# EAGLE board FMU_V.2 (EAGLE 7.4.0), part 1 of 2
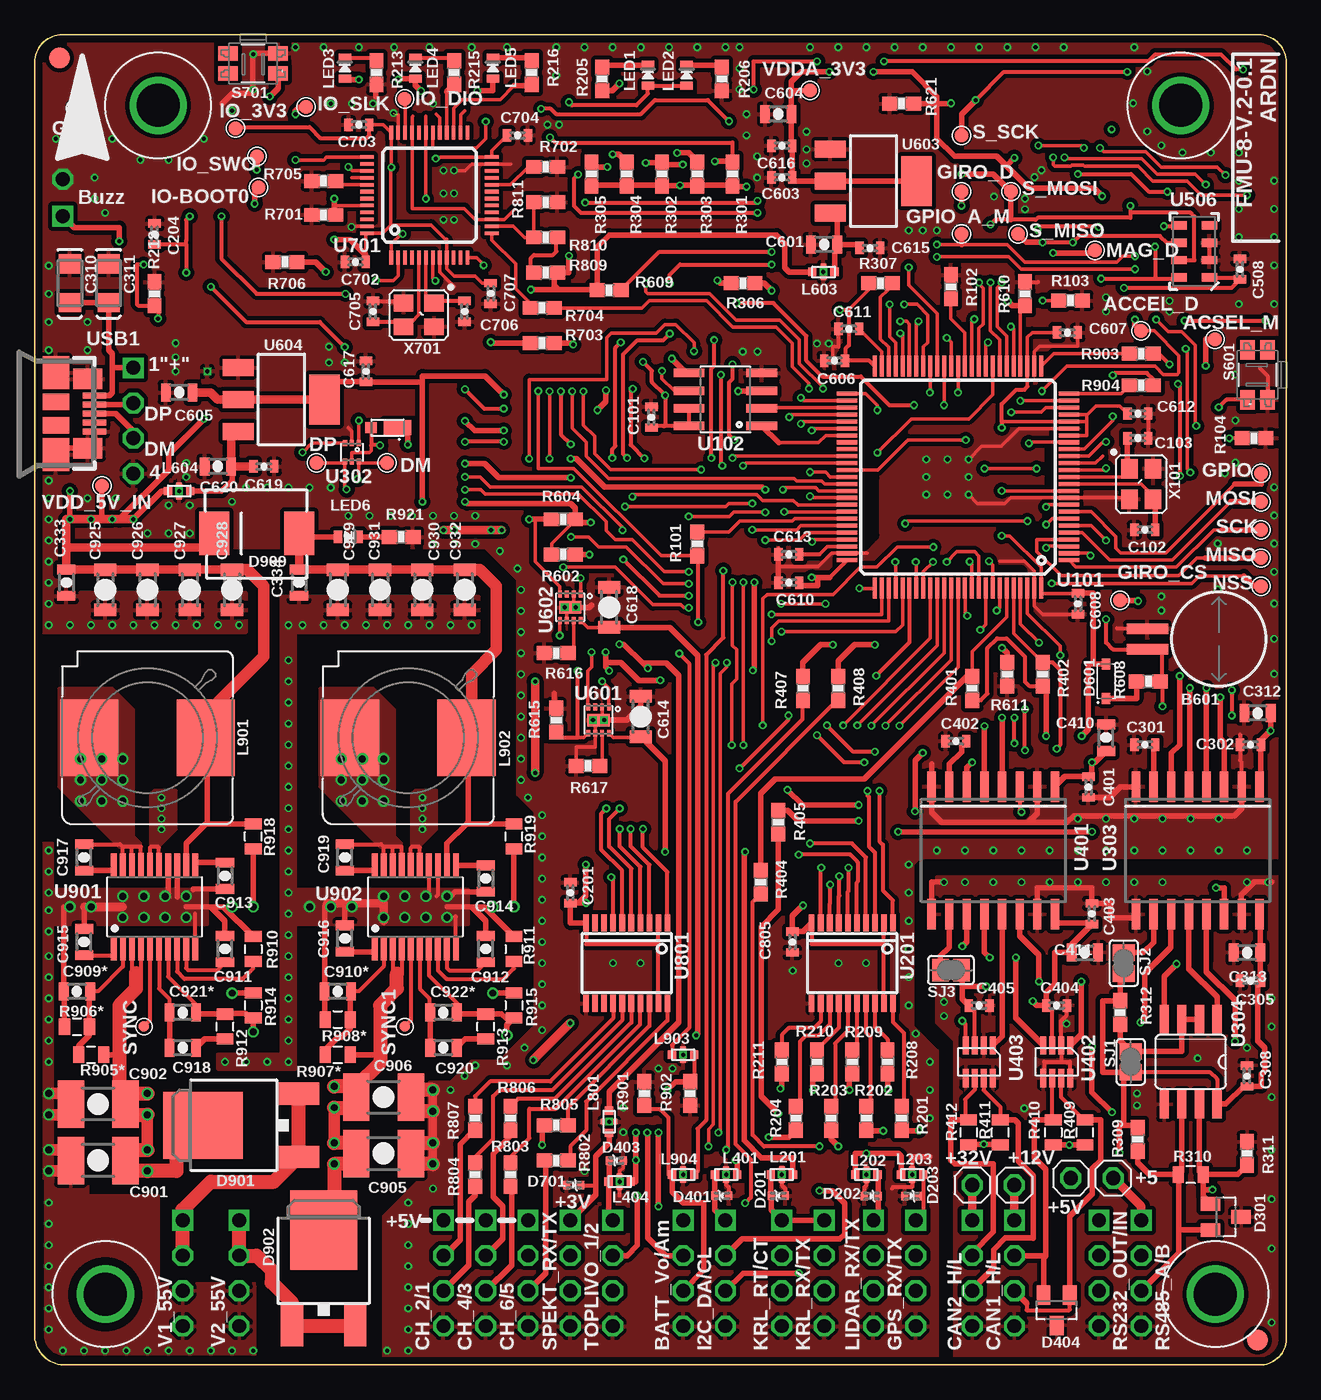
[diagram p10: board, top side]
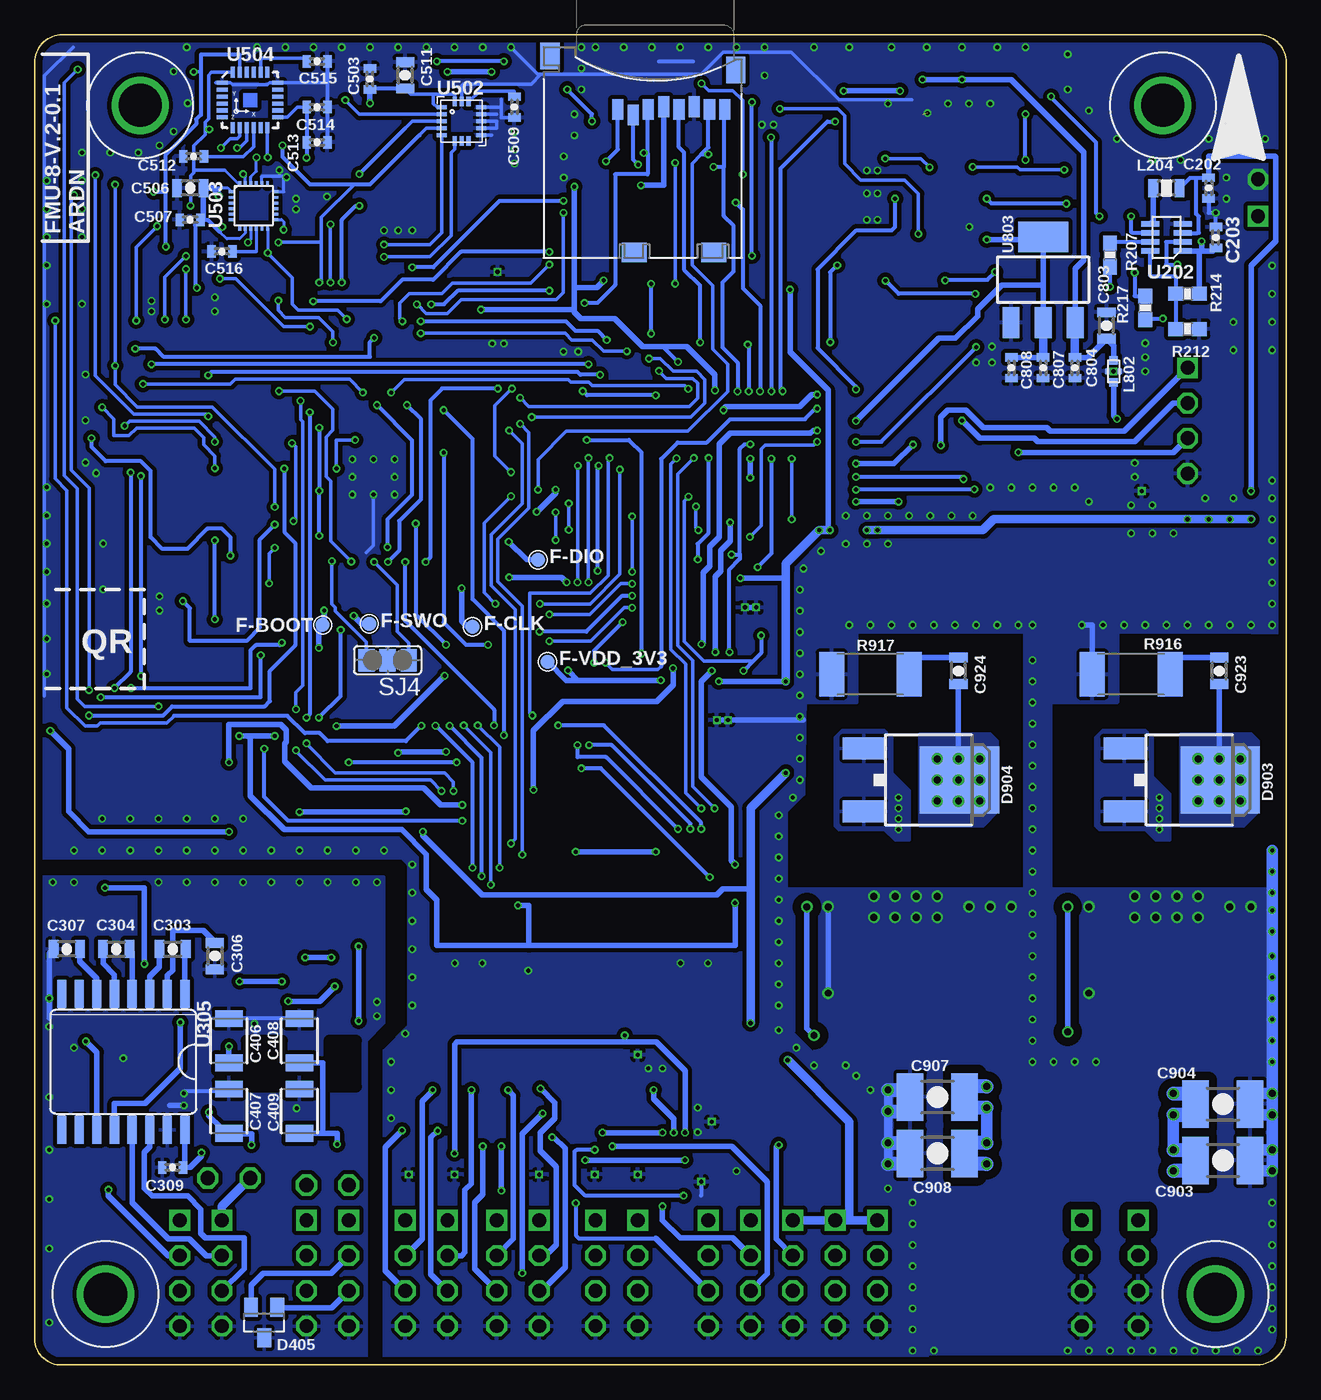
[diagram p11: board, bottom side, seen from below]

Size 90.2 x 95.9 mm. Coordinates in mm from the lower left corner, seen from the top.
Outline: 0,2 0,93.9 arc-90 2,95.9 88.2,95.9 arc-90 90.2,93.9 90.2,2 arc-90 88.45,0 2.25,0 arc-90 0,2
Copper layers (1*16): Top 0.035mm / dielectric 2mm / Bottom 0.035mm
Design rules "default *": minimum track width 10mil, minimum drill 0.3mm, track to track 4mil, track to pad 4mil, pad to pad 4mil, via to via 4mil, smd to smd 4mil, copper to edge 20mil, drill to drill 8mil, minimum pad ring 0.125mm, minimum via ring 0.125mm, stop-mask expansion 1mil, vias tented up to drill 0.31mm, thermal gap 10mil
Net classes: 0 signal: width 0.15 mm, drill 0.15 mm, clearance 0.152 mm; 1 power: width 0.15 mm, drill 0.2 mm, clearance 0.152 mm
tRestrict: area 59.7,59.1 to 60.5,64; area 69.6,57.2 to 71.1,57.3; area 73.2,63.6 to 73.4,65.8; 2 lines
bRestrict: area 67.1,20.1 to 69,23.4; area 72.4,20.1 to 74.9,23.4; area 73.5,91.6 to 73.8,91.9

## Footprints (pad centres in the part's own frame; a part is rotated, then mirrored left to right if it is on the bottom)
1X01 = drill 1.016 octagon: 1 0,0
PAD.04X.04 = smd 1.016 x 1.016: P$1 0,0
MS621FE = smd 3 x 0.75: 1 5.15,0.75; 2 5.15,-0.75
0603-CAP = smd 0.6 x 0.9: P$1 -0.75,0; P$2 0.75,0
0805-CAP = smd 0.7 x 1.3: P$1 -0.95,0; P$2 0.95,0
EIA3216 = smd 1.4 x 1.6: A 1.4,0; C -1.4,0
1210 = smd 1.2 x 2: 1 -1.6,0; 2 1.6,0
1206-CAP = smd 0.9 x 1.6: P$1 -1.45,0; P$2 1.45,0
1812-CAP = smd 1.905 x 3.429: 1 -1.968,0; 2 1.968,0
0402-TVS = smd 0.5 x 0.6: A 0.5,0; C -0.5,0
SOT23 = smd 1 x 1.4: 1 -0.95,-1.1; 2 0.95,-1.1; 3 0,1.1
MICROSMP = smd 0.8 x 0.8: ANODE 0.65,0 | smd 2 x 1.1: CATHODE -1.25,0
SOD323 = smd 0.8 x 0.6: A 1.25,0; C -1.25,0
DPAK = smd 1.6 x 3: 1 -2.28,-5.31; 3 2.28,-5.31 | smd 4.826 x 5.715: 4 0,1.588
SMA-DIODE = smd 2.16 x 3.15: A -3.05,0; C 3.05,0
HEADER_2.54MM-1X04 = drill 1 square: 1 -3.81,0 | drill 1 octagon: 2 -1.27,0; 3 1.27,0; 4 3.81,0
FIDUCIAL-1.5X3 = smd 1.5 x 1.5: 1 0,0
KYOCERA-KNH16-DA = smd 0.6 x 0.6: P$1 -0.8,0; P$2 0.8,0 | smd 0.4 x 0.4: P$3 0,-0.4; P$4 0,0.4 | drill 0.3 pad 0.4 square: P$5 0,0
0805-IND = smd 0.7 x 1.3: P$1 -0.95,0; P$2 0.95,0
SLF10145 = smd 4.2 x 5.5: P$1 -4.196,0; P$2 4.206,0
0603-LED = smd 0.6 x 0.9: A 0.75,0; C -0.75,0
MOUNT-HOLE3.1 = drill 3.1 pad 4.1: P$1 0,0
0603-RES = smd 1.1 x 1: 1 -0.85,0; 2 0.85,0
0805 = smd 0.8 x 1.2: 1 -0.9,0; 2 0.9,0
R2512 = smd 1.8 x 3.2: 1 -2.8,0; 2 2.8,0
EVQP7J01K = smd 1.4 x 1.05: A1 -1.8,0.725; A2 1.8,0.725; B3 -1.8,-0.725; B4 1.8,-0.725
SJ = smd 1.168 x 1.6: 1 -0.762,0; 2 0.762,0
SJ_2 = smd 1.168 x 1.6: 1 -1.524,0; 2 0,0; 3 1.524,0
PAD.03X.03 = smd 0.762 x 0.762: P$1 0,0
TQFP100 = smd 1.5 x 0.29: 1 -8,6; 2 -8,5.5; 3 -8,5; 4 -8,4.5; 5 -8,4; 6 -8,3.5; 7 -8,3; 8 -8,2.5; 9 -8,2; 10 -8,1.5; 11 -8,1; 12 -8,0.5; 13 -8,0; 14 -8,-0.5; 15 -8,-1; 16 -8,-1.5; 17 -8,-2; 18 -8,-2.5; 19 -8,-3; 20 -8,-3.5; 21 -8,-4; 22 -8,-4.5; 23 -8,-5; 24 -8,-5.5; 25 -8,-6; 51 8,-6; 52 8,-5.5; 53 8,-5; 54 8,-4.5; 55 8,-4; 56 8,-3.5; 57 8,-3; 58 8,-2.5; 59 8,-2; 60 8,-1.5; 61 8,-1; 62 8,-0.5; 63 8,0; 64 8,0.5; 65 8,1; 66 8,1.5; 67 8,2; 68 8,2.5; 69 8,3; 70 8,3.5; 71 8,4; 72 8,4.5; 73 8,5; 74 8,5.5; 75 8,6 | smd 0.29 x 1.5: 26 -6,-8; 27 -5.5,-8; 28 -5,-8; 29 -4.5,-8; 30 -4,-8; 31 -3.5,-8; 32 -3,-8; 33 -2.5,-8; 34 -2,-8; 35 -1.5,-8; 36 -1,-8; 37 -0.5,-8; 38 0,-8; 39 0.5,-8; 40 1,-8; 41 1.5,-8; 42 2,-8; 43 2.5,-8; 44 3,-8; 45 3.5,-8; 46 4,-8; 47 4.5,-8; 48 5,-8; 49 5.5,-8; 50 6,-8; 76 6,8; 77 5.5,8; 78 5,8; 79 4.5,8; 80 4,8; 81 3.5,8; 82 3,8; 83 2.5,8; 84 2,8; 85 1.5,8; 86 1,8; 87 0.5,8; 88 0,8; 89 -0.5,8; 90 -1,8; 91 -1.5,8; 92 -2,8; 93 -2.5,8; 94 -3,8; 95 -3.5,8; 96 -4,8; 97 -4.5,8; 98 -5,8; 99 -5.5,8; 100 -6,8
SO08 = smd 0.61 x 2.21: 1 -1.905,-2.616; 2 -0.635,-2.616; 3 0.635,-2.616; 4 1.905,-2.616; 5 1.905,2.616; 6 0.635,2.616; 7 -0.635,2.616; 8 -1.905,2.616
R-PDSO-G20 = smd 0.4 x 1.2: 1 -2.925,-2.9; 2 -2.275,-2.9; 3 -1.625,-2.9; 4 -0.975,-2.9; 5 -0.325,-2.9; 6 0.325,-2.9; 7 0.975,-2.9; 8 1.625,-2.9; 9 2.275,-2.9; 10 2.925,-2.9; 11 2.925,2.9; 12 2.275,2.9; 13 1.625,2.9; 14 0.975,2.9; 15 0.325,2.9; 16 -0.325,2.9; 17 -0.975,2.9; 18 -1.625,2.9; 19 -2.275,2.9; 20 -2.925,2.9
SOT23-8 = smd 0.42 x 1.3: 1 -0.975,-1.175; 2 -0.325,-1.175; 3 0.325,-1.175; 4 0.975,-1.175; 5 0.975,1.175; 6 0.325,1.175; 7 -0.325,1.175; 8 -0.975,1.175
MICROSD = smd 0.8 x 1.5: 1 -1.94,2.7; 2 -0.84,2.3; 3 0.26,2.7; 4 1.36,2.9; 5 2.46,2.7; 6 3.56,2.9; 7 4.66,2.7; 8 5.76,2.7 | smd 1.4 x 1.9: NC -6.85,6.55; NC3 6.55,5.55 | smd 1.8 x 1.4: NC1 -0.75,-7.6; NC2 4.95,-7.6
SOT563-6 = smd 0.3 x 0.45: 1 -0.5,-0.675; 2 0,-0.675; 3 0.5,-0.675; 4 0.5,0.675; 5 0,0.675; 6 -0.5,0.675
SO-16W = smd 0.6 x 2.2: 1 -4.445,-4.6; 2 -3.175,-4.6; 3 -1.905,-4.6; 4 -0.635,-4.6; 5 0.635,-4.6; 6 1.905,-4.6; 7 3.175,-4.6; 8 4.445,-4.6; 9 4.445,4.6; 10 3.175,4.6; 11 1.905,4.6; 12 0.635,4.6; 13 -0.635,4.6; 14 -1.905,4.6; 15 -3.175,4.6; 16 -4.445,4.6
SO08' = smd 0.66 x 2.032: 1 -1.905,-3.073; 2 -0.635,-3.073; 3 0.635,-3.073; 4 1.905,-3.073; 5 1.905,3.073; 6 0.635,3.073; 7 -0.635,3.073; 8 -1.905,3.073
SO16L = smd 0.66 x 2.032: 1 -4.445,-4.902; 2 -3.175,-4.902; 3 -1.905,-4.902; 4 -0.635,-4.902; 5 0.635,-4.902; 6 1.905,-4.902; 7 3.175,-4.902; 8 4.445,-4.902; 9 4.445,4.902; 10 3.175,4.902; 11 1.905,4.902; 12 0.635,4.902; 13 -0.635,4.902; 14 -1.905,4.902; 15 -3.175,4.902; 16 -4.445,4.902
LGA-16-3PX5P = smd 0.7 x 0.3: 1 -1.425,1; 2 -1.425,0.5; 3 -1.425,0; 4 -1.425,-0.5; 5 -1.425,-1; 9 1.425,-1; 10 1.425,-0.5; 11 1.425,0; 12 1.425,0.5; 13 1.425,1 | smd 0.3 x 0.7: 6 -0.5,-1.425; 7 0,-1.425; 8 0.5,-1.425; 14 0.5,1.425; 15 0,1.425; 16 -0.5,1.425
QFN = smd 0.4 x 0.21: 1 -1.58,1; 2 -1.58,0.6; 3 -1.58,0.2; 4 -1.58,-0.2; 5 -1.58,-0.6; 6 -1.58,-1; 13 1.58,-1; 14 1.58,-0.6; 15 1.58,-0.2; 16 1.58,0.2; 17 1.58,0.6; 18 1.58,1 | smd 0.21 x 0.4: 7 -1,-1.58; 8 -0.6,-1.58; 9 -0.2,-1.58; 10 0.2,-1.58; 11 0.6,-1.58; 12 1,-1.58; 19 1,1.58; 20 0.6,1.58; 21 0.2,1.58; 22 -0.2,1.58; 23 -0.6,1.58; 24 -1,1.58
QFN-24 = smd 0.8 x 0.29: 1 -2,1.25; 2 -2,0.75; 3 -2,0.25; 4 -2,-0.25; 5 -2,-0.75; 6 -2,-1.25; 13 2,-1.25; 14 2,-0.75; 15 2,-0.25; 16 2,0.25; 17 2,0.75; 18 2,1.25 | smd 0.29 x 0.8: 7 -1.25,-2; 8 -0.75,-2; 9 -0.25,-2; 10 0.25,-2; 11 0.75,-2; 12 1.25,-2; 19 1.25,2; 20 0.75,2; 21 0.25,2; 22 -0.25,2; 23 -0.75,2; 24 -1.25,2
MS5611-01BA = smd 1.1 x 0.6: 1 -1.1,1.875; 2 -1.1,0.625; 3 -1.1,-0.625; 4 -1.1,-1.875; 5 1.1,-1.875; 6 1.1,-0.625; 7 1.1,0.625; 8 1.1,1.875
QFN8-DSG = smd 0.28 x 0.5: 1 -0.75,-0.95; 2 -0.25,-0.95; 3 0.25,-0.95; 4 0.75,-0.95; 5 0.75,0.95; 6 0.25,0.95; 7 -0.25,0.95; 8 -0.75,0.95 | smd 1.6 x 0.9: GND 0,0 | drill 0.3 square: P$2 -0.4,0; P$3 0.4,0
SOT-223 = smd 1.219 x 2.235: 1 -2.311,-3.099; 2 0,-3.099; 3 2.311,-3.099 | smd 3.6 x 2.2: 4 0,3.099
TQFP48 = smd 0.26 x 1: 1 -2.75,-4.5; 2 -2.25,-4.5; 3 -1.75,-4.5; 4 -1.25,-4.5; 5 -0.75,-4.5; 6 -0.25,-4.5; 7 0.25,-4.5; 8 0.75,-4.5; 9 1.25,-4.5; 10 1.75,-4.5; 11 2.25,-4.5; 12 2.75,-4.5; 25 2.75,4.5; 26 2.25,4.5; 27 1.75,4.5; 28 1.25,4.5; 29 0.75,4.5; 30 0.25,4.5; 31 -0.25,4.5; 32 -0.75,4.5; 33 -1.25,4.5; 34 -1.75,4.5; 35 -2.25,4.5; 36 -2.75,4.5 | smd 1 x 0.26: 13 4.5,-2.75; 14 4.5,-2.25; 15 4.5,-1.75; 16 4.5,-1.25; 17 4.5,-0.75; 18 4.5,-0.25; 19 4.5,0.25; 20 4.5,0.75; 21 4.5,1.25; 22 4.5,1.75; 23 4.5,2.25; 24 4.5,2.75; 37 -4.5,2.75; 38 -4.5,2.25; 39 -4.5,1.75; 40 -4.5,1.25; 41 -4.5,0.75; 42 -4.5,0.25; 43 -4.5,-0.25; 44 -4.5,-0.75; 45 -4.5,-1.25; 46 -4.5,-1.75; 47 -4.5,-2.25; 48 -4.5,-2.75
TSSOP20 = smd 0.42 x 1.78: 1 -2.926,-2.975; 2 -2.276,-2.975; 3 -1.626,-2.975; 4 -0.976,-2.975; 5 -0.326,-2.975; 6 0.324,-2.975; 7 0.974,-2.975; 8 1.625,-2.98; 9 2.277,-2.98; 10 2.929,-2.98; 11 2.93,2.975; 12 2.28,2.975; 13 1.63,2.975; 14 0.98,2.975; 15 0.323,2.979; 16 -0.322,2.979; 17 -0.979,2.979; 18 -1.624,2.975; 19 -2.281,2.975; 20 -2.932,2.975
MOLEX-47346-0001 = smd 1.7 x 0.44: D+ 2.8,0; D- 2.8,0.65; GND 2.8,-1.3; ID 2.8,-0.65; VBUS 2.8,1.3 | smd 1.9 x 2.375: GND1 0,2.95; GND4 0,-2.95 | smd 2.1 x 1.475: GND2 2.3,2.5; GND3 2.3,-2.5 | smd 1.9 x 1.175: GND5 0,-0.838; GND6 0,0.838
OSCILLATOR-3.2X2.5 = smd 1.4 x 1.2: 1 -1.1,-0.85; 2 1.1,-0.85; 3 1.1,0.85; 4 -1.1,0.85

## Placement (x,y rotation side)
+5  [1X01]  77.72,13.46 0 top
+5V  [1X01]  74.68,13.46 0 top
+12V  [1X01]  70.61,12.96 0 top
+32V  [1X01]  67.56,12.96 0 top
ACCEL_D  PAD.04  [PAD.04X.04]  79.73,74.55 0 top
ACSEL_M  PAD.04  [PAD.04X.04]  85.06,73.94 0 top
B601  MS621FE  [MS621FE]  85.34,52.33 180 top
C101  0u1  [0603-CAP]  44.45,68.33 90 top
C102  8p  [0603-CAP]  80.01,60.2 180 top
C103  8p  [0603-CAP]  79.5,66.8 180 top
C201  0u1  [0603-CAP]  38.61,34.04 90 top
C202  1u  [0603-CAP]  5.59,84.84 270 bottom
C203  5n6  [0603-CAP]  5.08,81.28 90 bottom
C204  0u47  [0603-CAP]  8.64,81.54 90 top
C301  0u1  [0603-CAP]  80.01,44.71 180 top
C302  0u1  [0603-CAP]  87.63,44.71 180 top
C303  1u  [0805-CAP]  80.26,29.97 0 bottom
C304  1u  [0805-CAP]  84.33,29.97 0 bottom
C305  0u1  [0603-CAP]  87.63,27.69 180 top
C306  1u  [0805-CAP]  77.22,29.47 270 bottom
C307  1u  [0805-CAP]  87.88,29.97 180 bottom
C308  0u1  [0603-CAP]  87.38,20.83 90 top
C309  0u1  [0603-CAP]  80.26,14.23 180 bottom
C310  100u  [EIA3216]  2.54,77.98 270 top
C311  100u  [EIA3216]  5.33,77.98 270 top
C312  10u  [0805-CAP]  88.14,46.99 180 top
C313  22u  [0805-CAP]  87.38,29.72 180 top
C333  0u1  [0805-CAP]  2.29,56.39 270 top
C334  0u1  [0805-CAP]  19.05,56.39 270 top
C401  0u1  [0603-CAP]  75.95,41.66 270 top
C402  0u1  [0603-CAP]  66.4,44.96 180 top
C403  0u1  [0603-CAP]  76.2,32.51 90 top
C404  0u1  [0603-CAP]  73.66,25.91 0 top
C405  0u1  [0603-CAP]  68.07,25.91 0 top
C406  0u33  [1210]  76.2,23.37 90 bottom
C407  0u33  [1210]  76.2,18.29 90 bottom
C408  0u33  [1210]  71.12,23.37 90 bottom
C409  0u33  [1210]  71.12,18.29 90 bottom
C410  10u  [0805-CAP]  77.22,45.21 90 top
C411  22u  [0805-CAP]  75.69,29.72 0 top
C503  0u1  [0603-CAP]  66.04,92.71 90 bottom
C506  10u/10V  [0805-CAP]  78.99,84.84 180 bottom
C507  0u1  [0603-CAP]  78.99,82.55 180 bottom
C508  0u1  [0603-CAP]  86.87,79 90 top
C509  0u47  [0603-CAP]  55.63,90.68 270 bottom
C511  10u/10V  [0805-CAP]  63.5,92.97 90 bottom
C512  2u2  [0603-CAP]  78.74,87.12 180 bottom
C513  2u2  [0603-CAP]  69.85,88.14 0 bottom
C514  0u1  [0603-CAP]  69.85,90.68 0 bottom
C515  0u01  [0603-CAP]  69.85,93.98 0 bottom
C516  0u1  [0603-CAP]  76.71,80.27 180 bottom
C601  10u/25V  [0805-CAP]  56.9,80.77 180 top
C603  1u  [0603-CAP]  53.85,85.6 180 top
C604  22u/25V  [0805-CAP]  53.59,90.17 180 top
C605  22u/25V  [0805-CAP]  10.41,70.11 180 top
C606  0u1  [0603-CAP]  57.66,72.39 180 top
C607  0u1  [0603-CAP]  74.42,74.42 0 top
C608  0u1  [0603-CAP]  75.18,54.87 270 top
C610  0u1  [0603-CAP]  54.36,56.39 180 top
C611  2u2  [0603-CAP]  58.67,74.68 180 top
C612  0u1  [0603-CAP]  79.5,68.58 0 top
C613  2u2  [0603-CAP]  54.36,58.42 180 top
C614  100u  [1206-CAP]  43.69,46.74 90 top
C615  0u1  [0603-CAP]  60.2,80.52 0 top
C616  0u1  [0603-CAP]  53.85,87.89 180 top
C617  0u1  [0603-CAP]  23.88,71.63 90 top
C618  100u  [1206-CAP]  41.4,54.61 90 top
C619  0u1  [0603-CAP]  16.51,64.77 0 top
C620  10u/25V  [0805-CAP]  13.21,64.77 180 top
C702  0u1  [0603-CAP]  23.11,79.5 180 top
C703  0u1  [0603-CAP]  23.37,89.41 180 top
C704  0u1  [0603-CAP]  34.8,88.65 0 top
C705  8p  [0603-CAP]  24.38,75.95 90 top
C706  8p  [0603-CAP]  30.99,75.95 90 top
C707  0u1  [0603-CAP]  32.87,77.24 270 top
C803  10u/25V  [0805-CAP]  12.95,74.93 90 bottom
C804  0u1  [0603-CAP]  15.24,71.88 270 bottom
C805  0u1  [0603-CAP]  54.61,30.48 270 top
C807  10u  [0603-CAP]  17.53,71.88 270 bottom
C808  1u  [0603-CAP]  19.81,71.88 270 bottom
C901  22u  [1812-CAP]  4.57,14.73 180 top
C902  22u  [1812-CAP]  4.57,18.8 180 top
C903  22u  [1812-CAP]  4.57,14.73 0 bottom
C904  22u  [1812-CAP]  4.57,18.8 0 bottom
C905  22u  [1812-CAP]  25.15,15.24 0 top
C906  22u  [1812-CAP]  25.15,19.31 0 top
C907  22u  [1812-CAP]  25.15,19.31 180 bottom
C908  22u  [1812-CAP]  25.15,15.24 180 bottom
C909*  [0805-CAP]  3.05,26.93 180 top
C910*  [0805-CAP]  21.84,26.93 180 top
C911  330p  [0805-CAP]  13.72,29.97 90 top
C912  330p  [0805-CAP]  32.51,29.97 90 top
C913  0u01  [0805-CAP]  13.72,35.26 270 top
C914  0u01  [0805-CAP]  32.51,35.05 270 top
C915  0u47/16V  [0805-CAP]  3.56,30.48 90 top
C916  0u47/16V  [0805-CAP]  22.35,30.74 90 top
C917  0u022  [0805-CAP]  3.56,36.58 90 top
C918  0u01  [0805-CAP]  10.67,22.86 180 top
C919  0u022  [0805-CAP]  22.35,36.58 90 top
C920  0u01  [0805-CAP]  29.46,22.86 180 top
C921*  [0805-CAP]  10.67,25.4 180 top
C922*  [0805-CAP]  29.46,25.4 180 top
C923  330p  [0805-CAP]  4.83,50.04 90 bottom
C924  330p  [0805-CAP]  23.62,50.04 90 bottom
C925  100u  [1206-CAP]  5.08,55.88 270 top
C926  100u  [1206-CAP]  8.13,55.88 270 top
C927  100u  [1206-CAP]  11.18,55.88 270 top
C928  33u  [1206-CAP]  14.22,55.88 270 top
C929  100u  [1206-CAP]  21.84,55.88 270 top
C930  100u  [1206-CAP]  27.94,55.88 270 top
C931  100u  [1206-CAP]  24.89,55.88 270 top
C932  33u  [1206-CAP]  30.99,55.88 270 top
D201  PESD0402-140  [0402-TVS]  53.59,12.19 0 top
D202  PESD0402-140  [0402-TVS]  60.3,12.17 180 top
D203  PESD0402-140  [0402-TVS]  63.2,12.17 180 top
D301  PESD1CAN  [SOT23]  85.85,10.67 270 top
D302  MSS1P4-M3/89A  [MICROSMP]  24.89,67.57 180 top
D401  PESD0402-140  [0402-TVS]  49.53,12.19 0 top
D403  PESD0402-140  [0402-TVS]  41.91,14.73 0 top
D404  PESD1CAN  [SOT23]  73.66,3.94 180 top
D405  PESD1CAN  [SOT23]  73.66,3.05 180 bottom
D601  RB751V40T1G  [SOD323]  77.22,49.28 90 top
D701  PESD0402-140  [0402-TVS]  38.86,12.96 180 top
D901  6CWQ10FN-M3  [DPAK]  13.72,17.27 90 top
D902  6CWQ10FN-M3  [DPAK]  20.83,8.13 0 top
D903  6CWQ10FN-M3  [DPAK]  6.35,42.17 270 bottom
D904  6CWQ10FN-M3  [DPAK]  25.15,42.17 270 bottom
D909  30BQ100  [SMA-DIODE]  16,59.95 180 top
DM  PAD.04  [PAD.04X.04]  25.4,65.03 180 top
DP  OTG_FS_DP  [PAD.04X.04]  20.32,65.03 180 top
F-BOOT  PAD.04  [PAD.04X.04]  69.44,53.34 0 bottom
F-CLK  PAD.04  [PAD.04X.04]  58.65,53.22 0 bottom
F-DIO  PAD.04  [PAD.04X.04]  53.92,58.04 0 bottom
F-SWO  PAD.04  [PAD.04X.04]  66.09,53.42 0 bottom
F-VDD_3V3  PAD.04  [PAD.04X.04]  53.24,50.7 0 bottom
GIRO_CS  PAD.04  [PAD.04X.04]  78.23,55.12 0 top
GIRO_D  PAD.04  [PAD.04X.04]  66.8,84.58 0 top
GND  PAD.04  [PAD.04X.04]  2.95,90.6 0 top
GPIO  PAD.04  [PAD.04X.04]  88.39,64.26 0 top
GPIO_A_M  PAD.04  [PAD.04X.04]  66.8,81.54 0 top
IO-BOOT0  PAD.04  [PAD.04X.04]  16.13,84.89 0 top
IO_3V3  PAD.04  [PAD.04X.04]  14.48,89.16 0 top
IO_DIO  PAD.04  [PAD.04X.04]  26.67,91.26 0 top
IO_SLK  PAD.04  [PAD.04X.04]  19.56,90.68 0 top
IO_SWO  PAD.04  [PAD.04X.04]  16.03,87.12 0 top
J201  HEADER_1X4  [HEADER_2.54MM-1X04]  56.9,6.61 270 bottom
J202  HEADER_1X4  [HEADER_2.54MM-1X04]  53.85,6.61 270 top
J203  HEADER_1X4  [HEADER_2.54MM-1X04]  60.45,6.61 270 top
J204  HEADER_1X4  [HEADER_2.54MM-1X04]  63.5,6.61 270 top
J301  HEADER_1X4  [HEADER_2.54MM-1X04]  79.76,6.61 270 top
J302  HEADER_1X4  [HEADER_2.54MM-1X04]  76.71,6.61 270 top
J303  HEADER_1X4  [HEADER_2.54MM-1X04]  7.11,68.07 270 top
J401  HEADER_1X4  [HEADER_2.54MM-1X04]  70.61,6.61 270 top
J402  HEADER_1X4  [HEADER_2.54MM-1X04]  67.56,6.61 270 top
J403  HEADER_1X4  [HEADER_2.54MM-1X04]  49.78,6.61 270 top
J404  HEADER_1X4  [HEADER_2.54MM-1X04]  41.66,6.61 270 top
J701  HEADER_1X4  [HEADER_2.54MM-1X04]  38.61,6.61 270 top
J901  HEADER_1X4  [HEADER_2.54MM-1X04]  10.67,6.61 270 top
J902  HEADER_1X4  [HEADER_2.54MM-1X04]  14.73,6.61 270 top
JP3  FIDUCIAL1.5X3  [FIDUCIAL-1.5X3]  88.14,1.78 0 top
JP4  FIDUCIAL1.5X3  [FIDUCIAL-1.5X3]  1.78,94.24 0 top
L201  KNH16C104DA5TS  [KYOCERA-KNH16-DA]  53.85,13.72 180 top
L202  KNH16C104DA5TS  [KYOCERA-KNH16-DA]  59.94,13.72 0 top
L203  KNH16C104DA5TS  [KYOCERA-KNH16-DA]  63.25,13.72 0 top
L204  LBR2012T470K/47uH  [0805-IND]  8.64,84.84 180 bottom
L401  KNH16C104DA5TS  [KYOCERA-KNH16-DA]  49.83,13.72 180 top
L404  KNH16C104DA5TS  [KYOCERA-KNH16-DA]  42.16,13.21 180 top
L603  KNH16C104DA5TS  [KYOCERA-KNH16-DA]  56.85,78.79 0 top
L604  KNH16C104DA5TS  [KYOCERA-KNH16-DA]  10.41,62.99 0 top
L801  KNH16C104DA5TS  [KYOCERA-KNH16-DA]  41.4,17.53 270 top
L802  KNH16C104DA5TS  [KYOCERA-KNH16-DA]  12.45,71.63 90 bottom
L901  DR120-330/33uH  [SLF10145]  8.13,45.21 0 top
L902  DR120-330/33uH  [SLF10145]  26.92,45.21 0 top
L903  KNH16C104DA5TS  [KYOCERA-KNH16-DA]  46.74,22.35 180 top
L904  KNH16C104DA5TS  [KYOCERA-KNH16-DA]  46.74,13.72 0 top
LED1  ART1608SECK  [0603-LED]  44.2,92.97 270 top
LED2  ARG1608GKC/T  [0603-LED]  46.99,92.97 270 top
LED3  ARG1608GKC/T  [0603-LED]  22.35,93.47 270 top
LED4  ART1608SECK  [0603-LED]  27.43,93.47 270 top
LED5  ART1608QBC/G  [0603-LED]  33.02,93.47 270 top
LED6  ARG1608GKC/T  [0603-LED]  22.61,59.69 180 top
M3_MOUNT1  MOUNT-HOLE3.1MM  [MOUNT-HOLE3.1]  85.1,5.1 0 top
M3_MOUNT2  MOUNT-HOLE3.1MM  [MOUNT-HOLE3.1]  5.1,5.1 0 top
M3_MOUNT3  MOUNT-HOLE3.1MM  [MOUNT-HOLE3.1]  8.9,90.8 0 top
M3_MOUNT4  MOUNT-HOLE3.1MM  [MOUNT-HOLE3.1]  82.6,90.8 0 top
MAG_D  PAD.04  [PAD.04X.04]  76.43,80.34 0 top
MISO  PAD.04  [PAD.04X.04]  88.39,58.17 0 top
MOSI  PAD.04  [PAD.04X.04]  88.39,62.23 0 top
NSS  PAD.04  [PAD.04X.04]  88.39,56.14 0 top
R101  470R  [0603-RES]  47.75,59.18 270 top
R102  10K  [0603-RES]  66.04,77.73 90 top
R103  10K  [0603-RES]  74.65,76.74 0 top
R104  1M  [0603-RES]  87.88,66.8 0 top
R201  120R  [0603-RES]  62.48,17.78 270 top
R202  120R  [0603-RES]  59.94,17.78 270 top
R203  120R  [0603-RES]  57.4,17.78 270 top
R204  120R  [0603-RES]  54.86,17.78 270 top
R205  510R  [0603-RES]  40.89,92.71 90 top
R206  330R  [0603-RES]  49.53,92.71 90 top
R207  9K09  [0603-RES]  12.7,80.01 90 bottom
R208  120R  [0603-RES]  61.47,21.85 270 top
R209  120R  [0603-RES]  58.93,21.85 270 top
R210  120R  [0603-RES]  56.39,21.85 270 top
R211  120R  [0603-RES]  53.85,21.85 270 top
R212  10K  [0603-RES]  7.11,74.68 180 bottom
R213  330R  [0603-RES]  24.64,93.17 90 top
R214  100K  [0603-RES]  7.11,77.22 0 bottom
R215  510R  [0603-RES]  30.23,93.17 90 top
R216  330R  [0603-RES]  35.81,93.17 90 top
R217  453K  [0603-RES]  10.16,76.2 270 bottom
R218  16K5  [0603-RES]  8.64,77.22 90 top
R301  100K  [0603-RES]  50.29,85.85 270 top
R302  100K  [0603-RES]  45.21,85.85 270 top
R303  100K  [0603-RES]  47.75,85.85 270 top
R304  100K  [0603-RES]  42.67,85.85 270 top
R305  100K  [0603-RES]  40.13,85.85 270 top
R306  1k5  [0603-RES]  51.05,77.98 180 top
R307  1k5  [0603-RES]  60.96,77.98 180 top
R309  1K2  [0603-RES]  79.5,16.26 270 top
R310  120R  [0805]  83.31,13.72 180 top
R311  1K2  [0603-RES]  87.38,15.24 90 top
R312  1K2  [0603-RES]  78.23,25.4 90 top
R401  1K5  [0603-RES]  67.56,48.77 270 top
R402  1K5  [0603-RES]  72.64,49.79 270 top
R404  120R  [0603-RES]  52.32,34.8 270 top
R405  120R  [0603-RES]  53.59,39.12 270 top
R407  10K/0.1%  [0603-RES]  55.37,48.77 270 top
R408  10K/0.1%  [0603-RES]  57.91,48.77 270 top
R409  60R  [0805]  75.69,16.77 90 top
R410  60R  [0805]  73.41,16.77 270 top
R411  60R  [0805]  69.6,16.77 90 top
R412  60R  [0805]  67.31,16.77 270 top
R602  1M  [0603-RES]  38.1,58.42 180 top
R604  1M  [0603-RES]  38.1,60.96 0 top
R608  1K  [0603-RES]  80.26,49.28 180 top
R609  10K/0.1%  [0603-RES]  41.4,77.47 180 top
R610  10K/0.1%  [0603-RES]  71.37,77.22 90 top
R611  10K  [0603-RES]  70.1,49.79 90 top
R615  10K  [0603-RES]  37.59,46.48 270 top
R616  25K5  [0603-RES]  37.59,51.31 0 top
R617  16K5  [0603-RES]  39.88,43.18 0 top
R621  220R  [0603-RES]  62.48,90.93 0 top
R701  10K  [0603-RES]  20.83,82.91 0 top
R702  10K  [0603-RES]  36.83,86.36 0 top
R703  220R  [0603-RES]  36.58,73.66 0 top
R704  220R  [0603-RES]  36.58,76.2 0 top
R705  220R  [0603-RES]  20.83,85.35 180 top
R706  220R  [0603-RES]  18.03,79.5 180 top
R802  220R  [0603-RES]  37.59,14.73 180 top
R803  220R  [0603-RES]  34.29,13.72 270 top
R804  220R  [0603-RES]  31.75,13.72 270 top
R805  220R  [0603-RES]  37.59,17.27 180 top
R806  220R  [0603-RES]  34.29,17.78 270 top
R807  220R  [0603-RES]  31.75,17.78 270 top
R809  10K/0.1%  [0603-RES]  36.83,78.74 180 top
R810  10K/0.1%  [0603-RES]  36.83,81.28 180 top
R811  10K/0.1%  [0603-RES]  36.83,83.82 0 top
R901  1M  [0603-RES]  43.94,19.56 270 top
R902  1M  [0603-RES]  47.24,19.56 90 top
R903  22K/1%  [0603-RES]  79.76,72.9 180 top
R904  22K/1%  [0603-RES]  79.76,70.61 180 top
R905*  [0805]  4.06,22.35 0 top
R906*  [0805]  3.05,24.39 0 top
R907*  [0805]  21.84,22.35 0 top
R908*  [0805]  21.84,24.89 0 top
R910  21K  [0805]  15.75,29.97 270 top
R911  21K  [0805]  34.54,29.97 270 top
R912  49K9  [0805]  13.72,24.39 90 top
R913  49K9  [0805]  32.51,24.39 90 top
R914  1K65  [0805]  15.75,25.91 270 top
R915  1K65  [0805]  34.54,25.91 270 top
R916  10R  [R2512]  11.18,49.79 180 bottom
R917  10R  [R2512]  29.97,49.79 180 bottom
R918  5K11  [0805]  15.75,38.1 90 top
R919  5K11  [0805]  34.54,38.1 90 top
R921  330R  [0603-RES]  26.42,59.69 180 top
S601  RESET  [EVQP7J01K]  88.14,71.38 90 top
S701  RESET  [EVQP7J01K]  15.75,93.83 180 top
S_MISO  PAD.04  [PAD.04X.04]  70.87,81.54 0 top
S_MOSI  PAD.04  [PAD.04X.04]  70.36,84.58 0 top
S_SCK  PAD.04  [PAD.04X.04]  66.8,88.65 0 top
SCK  PAD.04  [PAD.04X.04]  88.39,60.2 0 top
SJ1  [SJ]  78.99,21.85 270 top
SJ2  [SJ]  78.49,28.96 270 top
SJ3  [SJ]  66.04,28.45 180 top
SJ4  [SJ_2]  64.77,50.8 180 bottom
SYNC  PAD.03  [PAD.03X.03]  7.87,24.39 0 top
SYNC1  PAD.03  [PAD.03X.03]  26.67,24.39 0 top
U101  STM32F4X7VX  [TQFP100]  66.55,64.01 180 top
U102  FM25V01  [SO08]  49.78,69.6 90 top
U201  TXS0108TSSOP-20  [R-PDSO-G20]  58.93,28.96 180 top
U202  LT3469  [SOT23-8]  8.64,81.28 90 bottom
U301  2908-05WB-MG  [MICROSD]  46.23,87.81 0 bottom
U302  NUF2042XV6  [SOT563-6]  22.86,65.79 180 top
U303  ADUM5402  [SO-16W]  83.82,37.09 180 top
U304  MAX13487E  [SO08']  83.31,21.85 180 top
U305  MAX232ECWE  [SO16L]  83.82,21.85 180 bottom
U401  ADUM5402  [SO-16W]  69.09,37.09 180 top
U402  MAX3051  [SOT23-8]  73.66,21.85 180 top
U403  MAX3051  [SOT23-8]  68.07,21.85 180 top
U502  ICM20608-G  [LGA-16-3PX5P]  59.44,89.66 0 bottom
U503  MPU-9250  [QFN]  74.42,83.57 0 bottom
U504  MPU-6000  [QFN-24]  74.68,91.19 0 bottom
U506  MS5611-01BA  [MS5611-01BA]  83.57,80.27 180 top
U601  BQ24315  [QFN8-DSG]  40.64,46.48 180 top
U602  BQ24315  [QFN8-DSG]  38.61,54.61 180 top
U603  LD1117ASTR  [SOT-223]  60.45,85.35 270 top
U604  LD1117ASTR  [SOT-223]  17.78,69.6 270 top
U701  STM32F10XCXT6  [TQFP48]  28.45,84.33 0 top
U801  TXS0108TSSOP-20  [R-PDSO-G20]  42.67,28.96 180 top
U803  LD1117ASTR  [SOT-223]  17.53,78.23 0 bottom
U901  LM5005  [TSSOP20]  8.64,33.02 0 top
U902  LM5005  [TSSOP20]  27.43,33.02 0 top
U$1  HEADER_1X4  [HEADER_2.54MM-1X04]  29.46,6.61 270 top
U$2  HEADER_1X4  [HEADER_2.54MM-1X04]  32.51,6.61 270 top
U$3  HEADER_1X4  [HEADER_2.54MM-1X04]  35.56,6.61 270 top
U$4  HEADER_1X4  [HEADER_2.54MM-1X04]  46.74,6.61 270 top
USB1  MOLEX-47346-0001  [MOLEX-47346-0001]  1.52,68.58 0 top
VDD_5V_IN  PAD.04  [PAD.04X.04]  4.85,63.38 0 top
VDDA_3V3  PAD.04  [PAD.04X.04]  55.88,91.87 0 top
X101  NX3225SA-24.000MHZ-STD-CSR-1  [OSCILLATOR-3.2X2.5]  79.76,63.5 270 top
X701  NX3225SA-24.000MHZ-STD-CSR-1  [OSCILLATOR-3.2X2.5]  27.69,75.69 180 top

## Tracks (layer width: path | path; a pad name or v marks a point on that pad's centre or on a via)
1  (via drill 0.3 pad 0.55)
  Top 0.254: 24.24,66.3 24.24,65.9 24.13,65.79 22.86,65.79 U302.5
  Top 0.305: D302.ANODE 24.24,66.3 v24.89,66.3
  Top 0.406: USB1.VBUS 5.36,69.88 5.59,70.11 5.59,71.88 | C310.A C311.A 5.33,73.15 5.59,72.9 5.59,71.88 | J303.1 5.59,71.88
  Bottom 0.406: v24.89,66.3 24.89,68.33 24.38,68.84 23.11,68.84 21.84,67.57 17.27,67.57 17.02,67.31 11.68,67.31 J303.1
!ACCEL_MAG_CS  (via drill 0.3 pad 0.55)
  Top 0.254: U101.9 73.06,62.01 v72.9,61.85 | v74.22,87.05 74.3,86.97 79.78,86.97 80.9,85.85 83.64,85.85 v84.4,85.09
  Top 0.406: ACSEL_M.P$1 84.4,73.94 v84.4,72.04
  Bottom 0.203: U503.22 74.62,85.65 74.22,86.06 v74.22,87.05
  Bottom 0.254: v72.9,61.85 72.9,64.57 77.39,69.07 82.8,69.07 84.4,70.67 v84.4,72.04 v84.4,85.09
!BARO_CS  (via drill 0.3 pad 0.55)
  Top 0.254: U101.88 66.55,50.29 v62.33,46.08
  Top 0.305: v81.38,82.1 82.42,82.1 U506.5 | v82.88,75.29 v88.72,75.29
  Bottom 0.254: v88.72,75.29 88.72,63.88 87.88,63.05 87.88,47.37 86.56,46.05 85.7,46.05 85.47,46.28 80.67,46.28 80.16,46.79 | v81.38,82.1 82.88,80.6 v82.88,75.29
  Bottom 0.305: 80.16,46.79 71.98,46.79 70.74,45.54 69.67,45.54 69.09,44.96 63.45,44.96 v62.33,46.08
!FMU-LED_AMBER  (via drill 0.3 pad 0.55)
  Top 0.254: U101.43 64.05,73.4 64.36,73.71 64.36,75.69 63.6,76.46 v62.66,76.46
  Top 0.305: v39.17,85.83 38.86,85.52 38.86,83.57 39.37,83.06 v52.09,83.06
  Top 0.406: v42.14,92.38 41.62,91.86 R205.1
  Bottom 0.254: v39.17,85.83 39.17,91.16 39.88,91.87 41.63,91.87 v42.14,92.38 | v62.66,76.46 62.64,76.46 61.98,75.8 60.45,75.8 59.46,76.79 52.6,76.79 52.09,77.29 v52.09,83.06
!FRAM_CS
  Top 0.254: U101.57 57,67.01 56.46,66.47 53.62,66.47
  Top 0.406: 53.62,66.47 U102.1
!GPIO_ACCEL_MAG_CS  (via drill 0.3 pad 0.55)
  Top 0.254: U101.16 75.97,65.51 77.01,66.55 v77.22,66.55 | v79.3,79.94 78.44,79.94 78,79.5 71.35,79.5 70.08,80.77 66.8,80.77 v65.02,80.77 | v80.82,75.36 81.69,74.5 82.68,74.5 83.64,73.54 83.64,67.77 v83.72,67.69
  Top 0.406: GPIO_A_M.P$1 66.8,80.77
  Bottom 0.254: v79.3,79.94 80.82,78.41 v80.82,75.36 | U502.5 60.86,81.64 61.72,80.77 v65.02,80.77 | v77.22,66.55 77.22,66.91 78.36,68.05 83.36,68.05 v83.72,67.69
  Bottom 0.305: 83.59,67.82 v83.72,67.69
!GYRO_CS  (via drill 0.3 pad 0.55)
  Top 0.254: U101.7 73.33,61.01 v72.9,60.58
  Top 0.406: GIRO_CS.P$1 79.48,55.12 v79.53,55.07
  Bottom 0.305: v79.53,55.07 79.02,54.56 79.02,52.2 74.93,52.2 73.97,53.16 73.97,59.51 v72.9,60.58
!IO-LED
  Top 0.254: U701.26 30.7,90.14 30.99,90.43
!IO-LED_AMBER
  Top 0.254: U701.28 29.7,91.79
  Top 0.406: 29.7,91.79 R215.1
!IO-LED_BLUE
  Top 0.254: 34.54,92.2 33.55,91.21 30.81,91.21 30.2,90.6 U701.27 | 35.7,92.2 R216.1
  Top 0.406: 34.54,92.2 35.7,92.2
!MPU_CS  (via drill 0.3 pad 0.55)
  Top 0.254: v76.78,87.73 77.06,87.45 80.09,87.45 81.18,86.36 85.24,86.36 v85.83,85.78 | U101.17 75.64,66.01 77.7,68.07 v77.7,68.38
  Bottom 0.254: U504.8 75.43,88.58 75.62,88.39 76.12,88.39 v76.78,87.73 | v85.83,85.78 85.83,71.33 83.06,68.56 77.88,68.56 v77.7,68.38
!SBUS_OUTPUT_EN
  Top 0.254: U701.40 22.86,85.58 22.86,85.6
!SPI_EXT_NSS  (via drill 0.3, 0.3 pad 0.55)
  Top 0.254: v72.9,58.91 73.03,59.03 74.53,59.03 U101.3 | 87.15,56.87 83.92,56.87 83.39,56.34 v73.3,56.34
  Top 0.406: 87.15,56.87 87.88,56.14 NSS.P$1
  Bottom 0.254: v72.9,58.91 73.3,58.5 v73.3,56.34
!VBUS_VALID
  Top 0.254: U101.15 76.44,65.01 76.96,65.53
!VDD_5V_HIPOWER_OC  (via drill 0.3 pad 0.55)
  Top 0.254: U601.4 39.88,47.45 39.88,50.04 40.13,50.29 v40.13,51.39 | U101.41 65.05,75.77 62.99,77.83 v62.99,79.12
  Top 0.305: v39.67,83.8 51.97,83.8 v52.09,83.92 | v37.92,70.18 37.92,67.08 v38.63,66.37
  Top 0.406: R602.1 v39.98,58.42
  Bottom 0.305: 39.37,58.42 39.37,58.12 40.13,57.36 v40.13,51.39 | v39.98,58.42 39.37,58.42 | v52.09,83.92 56.67,83.92 61.47,79.12 v62.99,79.12 | 39.37,58.42 39.37,66.04 39.04,66.37 v38.63,66.37 | v37.92,70.18 37.92,76.38 39.17,77.62 39.17,83.29 v39.67,83.8
!VDD_5V_PERIPH_EN  (via drill 0.3 pad 0.55)
  Top 0.254: R615.2 37.59,45.21 | 39.12,45.21 39.57,45.21 U601.5 | U101.67 56.97,62 56.95,61.98 55.02,61.98 54.69,62.31 52.48,62.31 52.05,62.74 43.23,62.74 v43.08,62.59 | v37.85,52.58 37.85,53.65 U602.5
  Top 0.305: v39.12,50.04 39.12,45.21 37.59,45.21
  Bottom 0.254: 38.41,50.75 41.99,50.75 43.38,52.15 43.38,62.28 v43.08,62.59
  Bottom 0.305: v37.85,52.58 37.85,51.31 38.41,50.75 v39.12,50.04
!VDD_5V_PERIPH_OC  (via drill 0.3 pad 0.55)
  Top 0.254: U602.4 37.86,56.12 36.07,57.91 36.07,60.96 | U101.46 62.55,74.21 v62.38,74.37 | v35.64,65.33 35.64,71.05 41.22,71.05 41.22,74.04 41.55,74.37 44.78,74.37 45.41,75.01 46.2,75.01 47.52,73.69 v47.52,73.08
  Top 0.406: R604.1 36.07,60.96 v35.64,60.96
  Bottom 0.254: v62.38,74.37 51.97,74.37 51.49,73.89 50.01,73.89 49.2,73.08 v47.52,73.08 | v35.64,60.96 v35.64,65.33
!VDD_BRICK_VALID  (via drill 0.3 pad 0.55)
  Top 0.254: U101.91 68.05,58.32 67.74,58.63 66.47,58.63 v65.73,57.89
  Bottom 0.254: SJ4.1 63.25,52.05 64.08,52.89 64.08,56.24 v65.73,57.89
!VDD_SERVO_VALID  (via drill 0.3 pad 0.55)
  Top 0.254: U101.93 69.05,57.68 v68.78,57.94
  Bottom 0.254: v68.78,57.94 68.78,54.84 68.53,54.59 68.53,54.36 66.29,52.12 SJ4.3
ACCEL_DRDY  (via drill 0.3 pad 0.55)
  Top 0.254: v72.59,70.21 74.4,72.01 80.75,72.01 81.36,71.4 82.35,71.4 82.47,71.53 82.47,72.77 80.7,74.55 ACCEL_D.P$1 | v79.3,79 71.09,79 70.21,79.89 v65.02,79.89 | U101.90 67.55,57.75 v67.39,57.91
  Top 0.406: ACCEL_D.P$1 79.3,74.98 v79.3,75.36
  Bottom 0.254: v72.59,70.21 70,70.21 68.71,68.91 68.71,67.39 69.19,66.91 69.19,64.04 68.86,63.71 68.86,59.39 v67.39,57.91 | v79.3,79 v79.3,75.36 | U502.6 59.94,87.64 60.2,87.38 60.2,81.41 61.72,79.89 v65.02,79.89
ALARM  (via drill 0.3 pad 0.55)
  Top 0.254: U101.77 61.05,54.1 v53.11,54.1 | v38.66,59.69 39.93,59.69 40.66,58.96 42.65,58.96 45.29,56.31 v47.14,56.31
  Top 0.305: v33.81,66.55 v31.01,66.55 | v12.7,77.73 15.24,75.19 20.55,75.19 v22.35,73.38
  Bottom 0.254: v53.11,54.1 50.19,54.1 47.98,56.31 v47.14,56.31 | v38.66,59.69 37.85,60.51 37.85,66.02 37.57,66.3 34.06,66.3 v33.81,66.55
  Bottom 0.305: v12.7,77.73 R207.1 | v31.01,66.55 29.18,66.55 v22.35,73.38
BATT_CURRENT_SENS
  Top 0.254: U101.26 73.44,72.9 R903.2
BATT_VOLTAGE_SENS
  Top 0.254: U101.25 78.3,70.01 R904.2
CAN1_RX  (via drill 0.3 pad 0.55)
  Top 0.305: U101.81 63.05,52.08 v60.66,49.68
  Top 0.406: U401.5 v68.45,46.05
  Bottom 0.406: v68.45,46.05 64.29,46.05 v60.66,49.68
CAN1_TX  (via drill 0.3 pad 0.55)
  Top 0.254: v63.5,57.89 63.55,57.84 U101.82
  Top 0.305: U401.3 70.99,39.98 v71.12,39.86 | v60.55,44.2 59,44.2 v57.1,46.1
  Top 0.406: v63.45,39.91 63.45,43.56 v64.01,44.12
  Bottom 0.305: v63.5,57.89 63.5,53.65 57.1,47.25 v57.1,46.1
  Bottom 0.406: v71.12,39.86 63.5,39.86 v63.45,39.91 | v60.55,44.2 63.93,44.2 v64.01,44.12
CAN2_RX  (via drill 0.3 pad 0.55)
  Top 0.254: 60.73,69.01 v60.73,68.84 60.73,69.19 59.91,70.01 U101.51
  Top 0.305: v59.79,43.44 58.34,43.44 v56.39,45.39
  Top 0.406: U401.6 67.18,43.06 v67.56,43.44
  Bottom 0.305: v59.79,43.44 v67.56,43.44 | v60.73,68.84 58.65,66.75 58.65,55.2 56.39,52.94 v56.39,45.39
CAN2_TX  (via drill 0.3 pad 0.55)
  Top 0.254: U101.92 68.55,53.39 v68.15,52.99
  Top 0.406: U401.4 v69.72,46.66
  Bottom 0.305: v68.15,52.99 68.15,48.24 v69.72,46.66
CH1
  Top 0.305: R807.2 31.69,16.93
  Top 0.406: 31.69,16.93 30.66,15.9 30.66,9.02 29.52,7.88 U$1.2
CH2
  Top 0.406: R804.2 31.75,12.22 31.29,11.76 31.29,7.17 U$1.3
CH3
  Top 0.406: R806.2 34.29,16.46 33.05,15.22 33.05,12.12 33.73,11.43 33.73,9.1 U$2.2
CH4
  Top 0.406: R803.2 34.37,12.79 34.37,7.19 U$2.3
CH5  (via drill 0.3 pad 0.55)
  Top 0.305: 36.58,17.27 R805.2
  Top 0.406: v36.58,15.85 36.58,17.27
  Bottom 0.406: v36.58,15.85 36.75,15.67 36.75,9.07 U$3.2
CH6
  Top 0.305: R802.2 36.73,14.73
  Top 0.406: U$3.3 36.83,6.61 36.83,14.65 R802.2
CURRENT  (via drill 0.3, 0.3 pad 0.55)
  Top 0.305: L903.P$1 47.54,20.7 R902.2
  Top 0.406: v45.59,19.81 46.19,20.41 R902.2 | v44.15,16.74 44.2,16.69 44.2,9.15 45.47,7.88 U$4.2
  Bottom 0.406: v45.59,19.81 45.59,19.18 44.15,17.73 v44.15,16.74
FMU-!RESET  (via drill 0.3 pad 0.55)
  Top 0.254: v77.22,64.65 77.08,64.51 U101.14
  Top 0.305: S601.A1 87.13,69.3 | 87.13,69.58 S601.A1 | 87.3,69.58 S601.A1 | 87.41,69.87 S601.A1 | S601.A1 85.88,69.58 v85.34,69.04
  Bottom 0.254: v77.22,64.65 77.22,65.53 78.03,66.35 78.03,66.86 78.72,67.54 82.86,67.54 83.41,66.98 84.51,66.98 84.51,68.2 v85.34,69.04
FMU-BOOT0  (via drill 0.3 pad 0.55)
  Top 0.254: U101.94 69.55,54.59 v69.34,54.38
  Top 0.406: R611.2 70.1,51.31 v69.72,51.69
  Bottom 0.254: 69.55,53.24 F-BOOT.P$1
  Bottom 0.406: v69.34,54.38 69.34,53.44 F-BOOT.P$1 69.72,53.06 v69.72,51.69
FMU-CH1  (via drill 0.3 pad 0.55)
  Top 0.254: U101.45 63.05,75.04 62.85,75.24 v62.38,75.24
  Top 0.305: U801.7 41.7,35.14 41.57,35.14 v41.55,35.16 | v50.8,43 54.33,46.54 v54.33,46.81 | v48.77,65.38 48.77,71.83 48.97,72.04 v48.97,73.89
  Bottom 0.254: v48.77,65.38 48.79,65.38 48.87,65.31 48.87,56.92 50.16,55.63 54.51,55.63 54.51,46.99 v54.33,46.81
  Bottom 0.305: v41.55,35.16 49.4,43 v50.8,43 | v48.97,73.89 49.63,74.55 51.23,74.55 51.92,75.24 v62.38,75.24
FMU-CH2  (via drill 0.3 pad 0.55)
  Top 0.254: U101.44 63.55,75.08 v63.7,75.24
  Top 0.305: U801.6 42.35,35.63 40.84,37.14 40.84,39.75 v41.2,40.11 | v45.77,74.35 45.29,73.87 43.43,73.87 42.39,72.82 42.39,65.69 v42.7,65.38 | v45.77,77.93 45.77,78.59 46.51,79.33 v53.11,79.33
  Bottom 0.254: v41.2,40.11 42.77,41.68 42.77,50.78 43.87,51.87 43.87,64.21 v42.7,65.38 | v53.11,79.33 54.46,77.98 60.1,77.98 60.86,77.22 63.22,77.22 63.91,76.53 63.91,75.44 v63.7,75.24
  Bottom 0.305: v45.77,74.35 v45.77,77.93
FMU-CH3  (via drill 0.3 pad 0.55)
  Top 0.254: U101.42 64.55,70.14 v64.52,70.11
  Top 0.305: U801.5 43,35.77 41.4,37.37 41.4,39.35 v42.16,40.11 | v43.1,70.36 42.95,70.21 42.95,66.35 v43.94,65.36
  Bottom 0.254: v64.52,70.11 63.58,71.05 51.74,71.05 51.56,70.87 50.27,70.87 50.01,70.61 43.36,70.61 v43.1,70.36 | v42.16,40.11 43.28,41.23 43.28,50.52 44.35,51.59 44.35,64.95 v43.94,65.36
FMU-CH4  (via drill 0.3 pad 0.55)
  Top 0.254: v64.77,58.96 62.15,58.96 60.71,57.51 59.51,57.51 57.56,55.55 52.78,55.55 52.48,55.25 v52.48,46.1 | U101.40 65.55,69.21 v65.53,69.19
  Top 0.305: U801.4 43.65,35.91 42.16,37.39 v42.16,38.64
  Bottom 0.305: v64.77,58.96 64.77,60.96 62.99,62.74 62.99,66.65 v65.53,69.19 | v42.16,38.64 42.16,39.09 49.17,46.1 v52.48,46.1
FMU-CH5  (via drill 0.3 pad 0.55)
  Top 0.254: U101.60 50.42,65.51 v50.29,65.38 | v50.29,56.42 50.29,51.87 50.6,51.56 50.6,49.43 50.24,49.08 v50.24,44.68
  Top 0.305: U801.3 44.3,36.05 42.95,37.39 v42.95,38.64
  Bottom 0.254: v50.29,65.38 v50.29,56.42
  Bottom 0.305: v42.95,38.64 42.95,39.02 48.62,44.68 v50.24,44.68
FMU-CH6  (via drill 0.3 pad 0.55)
  Top 0.254: U101.61 51.24,65.01 v51.05,64.82 | v51.08,56.42 v51.08,44.68
  Top 0.305: U801.1 45.6,35.53 43.84,37.29 v43.84,38.64
  Bottom 0.254: v51.08,56.42 51.05,56.44 v51.05,64.82
  Bottom 0.305: v43.84,38.64 49.02,43.82 51.08,43.82 v51.08,44.68
FMU-I2C1_SCL
  Top 0.254: R401.1 67.56,51.44 70.05,53.92 U101.95
  Top 0.406: R404.1 52.32,41.2 53.37,42.24 59.79,42.24 67.17,49.62 R401.1
FMU-I2C1_SDA  (via drill 0.3 pad 0.55)
  Top 0.254: U101.96 70.55,52.73 R402.1
  Top 0.305: R402.1 73.37,50.64 73.91,50.09 73.91,44.68 v73.66,44.42
  Top 0.406: R405.1 54.27,39.97 55.02,39.22 v59.38,39.22
  Bottom 0.305: v59.38,39.22 71.93,39.22 73.66,40.95 v73.66,44.42
FMU-I2C2_SCL  (via drill 0.3 pad 0.55)
  Top 0.254: U101.47 62.05,73.69 61.62,74.12 v61.62,76.46
  Top 0.406: R306.1 52.58,77.98 v53.11,77.45
  Bottom 0.305: v61.62,76.46 60.71,76.46 59.72,77.45 v53.11,77.45
FMU-I2C2_SDA
  Top 0.254: U101.48 61.55,73.38 60.96,73.97 60.96,76.96 61.47,77.47 61.47,77.64 R307.1
FMU-SWCLK  (via drill 0.3 pad 0.55)
  Top 0.254: v59.44,55.98 60.52,55.98 U101.76
  Bottom 0.406: v59.44,55.98 59.44,53.62 59.03,53.22 F-CLK.P$1
FMU-SWDIO  (via drill 0.3 pad 0.55)
  Top 0.254: U101.72 56.21,59.51 v56.03,59.34
  Bottom 0.406: v56.03,59.34 54.74,58.04 F-DIO.P$1
FMU-SWO  (via drill 0.3 pad 0.55)
  Top 0.254: v67.21,54 67.06,54.16 U101.89
  Bottom 0.406: v67.21,54 66.62,53.42 F-SWO.P$1
FMU-UART4_RX  (via drill 0.3 pad 0.55)
  Top 0.254: U101.24 71.06,69.51 v71.04,69.5
  Top 0.305: v71.37,44.3 v71.37,47.27 | U201.1 61.85,33.48 61.14,34.19 61.14,37.49 60.88,37.75 v60.88,41.38
  Bottom 0.254: v71.37,47.27 71.37,48.49 70.89,48.97 70.89,68 71.04,68.15 v71.04,69.5 | v71.37,44.3 71.37,44.27 69.27,42.17 61.67,42.17 v60.88,41.38
FMU-UART4_TX  (via drill 0.3 pad 0.55)
  Top 0.254: U101.23 72.87,69.01 72.54,68.68 v70.38,68.68
  Top 0.305: v70.61,44.81 v70.61,46.66 | v60.02,41.38 60.02,41.05 60.12,40.95 60.12,37.37 60.55,36.93 U201.3
  Bottom 0.254: v60.02,41.38 60.02,42.04 60.66,42.67 68.53,42.67 70.61,44.76 v70.61,44.81
  Bottom 0.305: v70.38,68.68 70.38,46.89 v70.61,46.66
FMU-UART7_RX  (via drill 0.3 pad 0.55)
  Top 0.254: U101.38 v66.55,70.11
  Top 0.305: v82.55,64.09 82.55,70.56 v82.4,70.72
  Top 0.406: U303.6 81.92,44.1 82.53,44.71 v82.53,49.66
  Bottom 0.254: v66.55,70.11 67.51,71.07 75.74,71.07 76.1,70.72 v82.4,70.72
  Bottom 0.305: v82.55,64.09 82.55,49.68 v82.53,49.66
FMU-UART7_TX  (via drill 0.3 pad 0.55)
  Top 0.254: v83.29,64.34 83.06,64.57 83.06,73.15 v82.96,73.26 | U101.39 66.05,73.73 v65.73,74.04
  Top 0.406: U303.4 v84.45,48.8
  Bottom 0.305: v83.29,64.34 83.29,49.96 v84.45,48.8 | v82.96,73.26 81.48,73.26 80.9,72.67 66.04,72.67 66.04,73.74 v65.73,74.04
FMU-UART8_RX  (via drill 0.3 pad 0.55)
  Top 0.254: U101.97 71.05,53.41 v72.39,52.07
  Top 0.406: v83.26,48.8 83.26,41.76 U303.5
  Bottom 0.305: v83.26,48.8 74.65,48.8 74.65,51.51 74.27,51.89 72.57,51.89 v72.39,52.07
FMU-UART8_TX  (via drill 0.3 pad 0.55)
  Top 0.254: U101.98 71.55,54.18 73.91,51.82 v73.91,51.16
  Top 0.406: U303.3 85.72,44.88 85.45,45.16 v85.45,48.14
  Bottom 0.305: v85.45,48.14 73.91,48.14 v73.91,51.16
FMU-USART2_CTS  (via drill 0.3 pad 0.55)
  Top 0.254: U101.84 64.55,52.38 v58.27,46.1
  Top 0.305: U201.9 56.65,35.8 v56.69,35.84
  Bottom 0.254: v56.69,35.84 56.69,44.53 v58.27,46.1
FMU-USART2_RTS  (via drill 0.3 pad 0.55)
  Top 0.254: U101.85 65.05,51.87 v59.28,46.1
  Top 0.305: U201.8 57.3,33.28 57.33,33.3 v57.33,34.62
  Bottom 0.254: v57.33,34.62 57.33,44.15 v59.28,46.1
FMU-USART2_RX  (via drill 0.3 pad 0.55)
  Top 0.254: U101.87 66.05,50.81 v61.32,46.08
  Top 0.305: U201.6 58.6,34.12 58.65,34.17 v58.65,35.84
  Bottom 0.305: v58.65,35.84 58.65,43.41 v61.32,46.08
FMU-USART2_TX  (via drill 0.3 pad 0.55)
  Top 0.254: U101.86 65.55,51.33 v60.3,46.08
  Top 0.305: U201.7 57.95,33.8 57.99,33.84 v57.99,35.23
  Bottom 0.305: v57.99,35.23 57.99,43.77 v60.3,46.08
FMU-USART3_RX  (via drill 0.3 pad 0.55)
  Top 0.254: U101.56 56.15,67.51 v56.01,67.36
  Top 0.305: v55.88,37.59 58.9,37.59 59.9,36.59 U201.4
  Bottom 0.254: v56.01,67.36 55.07,66.42 55.07,62.08 57.3,59.84 57.3,56.19 55.58,54.46 55.58,37.9 v55.88,37.59
FMU-USART3_TX  (via drill 0.3 pad 0.55)
  Top 0.254: U101.55 55.38,68.01 v55.22,67.85
  Top 0.305: v55.07,36.78 58.78,36.78 59.31,36.25 59.31,34.83 59.25,34.77 U201.5
  Bottom 0.254: v55.22,67.85 54.59,67.21 54.59,61.78 56.82,59.54 56.82,56.47 55.07,54.71 v55.07,36.78
FMU-VDD_3V3  (via drill 0.3 pad 0.55)
  Top 0.254: C608.P$1 72.55,55.62 U101.100 | 47.14,67.67 U102.8 | 40.13,85.04 R305.2 | 42.67,85.04 R304.2 | 47.75,85.04 R303.2 | 69.7,68.01 U101.21 75.82,68.01 | 75.82,68.51 75.87,68.51 76.48,69.12 78.22,69.12 C612.P$1 | U101.11 69.71,63.01 v69.7,63.02 | 71.55,70.53 U101.28 71.55,74.09 71.88,74.42 C607.P$1 | U101.19 75.82,67.01 75.82,68.01 | U101.100 | U101.100 72.55,57.5 70.28,59.77 v69.7,59.77 | 45.44,67.77 45.34,67.67 | U101.22 75.82,68.51 | 75.82,68.51 75.82,68.01 | R604.2 38.95,60.9 37.25,59.2 R602.2 | R307.2 60.11,77.51 58.67,76.08
  Top 0.305: 50.29,84.94 R301.2 50.29,85.04 | 47.14,68.99 U102.7 U102.8 | 45.21,85.04 R302.2 | 71.55,70.53 71.32,70.31 70.74,70.31 69.7,69.27 69.7,68.01 v69.7,67.57 | 47.14,67.67 45.34,67.67 44.54,67.67 C101.P$1 | 45.44,67.77 v45.44,69.9 44.48,70.87 44.48,71.68 v43.84,72.32 | U101.75 57.31,56.77 | v58.04,76.08 58.67,76.08 58.67,73.51 58.42,73.26 58.42,72.4 C606.P$1 60.17,72.39 U101.50 | U201.10 56,30.33 61.2,30.33 | 61.2,30.33 U201.2 | U801.10 39.75,30.33 44.95,30.33 | U801.2 44.96,30.33 44.95,30.33 | U801.19 44.95,30.33 | U201.19 61.2,30.33 | R401.2 68.19,47.92 68.66,48.39 68.66,51.67 69.37,52.38 70.05,52.38 71.37,51.06 71.37,49.25 71.68,48.95 72.63,48.95 R402.2
  Top 0.406: 50.29,84.94 v51.31,84.94 | 40.13,85.04 42.67,85.04 45.21,85.04 | 50.29,85.04 47.75,85.04 v46.51,85.04 46.51,85 R302.2 | v51.87,56.42 51.87,50.17 v51.77,50.07 | 57.31,56.77 v56.01,56.77 56.44,56.77 56.44,56.19 55.11,56.19 C610.P$1 | U201.10 55.38,31.23 C805.P$1 54.6,31.24 54.6,32.35 v55.37,33.12 | v72.9,45.34 72.9,48.94 R402.2 | v50.7,70.21 52.38,70.21 U102.3 | v41.4,50.04 41.15,50.29 41.15,50.65 | 41.15,50.65 v41.15,51.39 | v40.08,60.73 39.18,60.73 R604.2 38.95,61.76 38.63,62.08 31.17,62.08 v31.01,62.23 | 76.28,50.53 75.95,50.53 75.95,45.82 v75.46,45.34 | 76.28,50.53 D601.A | C608.P$1 75.2,55.63 76.28,55.63 76.28,50.53 | v39.73,33.3 39.22,33.3 | 39.22,33.3 C201.P$1 38.61,31.86 U801.10 | v39.73,36.07 39.73,33.81 39.22,33.3 | v45.09,49.35 43.54,49.35 42.24,50.65 41.15,50.65 | v40.56,68.84 41.17,69.45 v41.17,70.26 | 27.94,71.3 | v27.94,62.23 27.94,70.87 | 27.94,70.87 27.94,71.3 | 20.88,70.82 20.94,70.88 C617.P$1 23.89,70.87 27.94,70.87 | R306.2 49.4,77.98 v49.2,78.18 | 27.94,71.3 32.46,71.3 v33.81,69.95
  Top 0.61: 20.88,70.82 U604.4 U604.2 13.21,69.6 12.7,70.11 C605.P$1
  Bottom 0.305: v50.7,70.21 50.39,69.9 v45.44,69.9 | U301.4 44.7,90.71 | v69.7,59.77 v69.7,63.02 v69.7,67.57 | v43.84,72.32 44.93,73.41 46.38,73.41 | 51.31,75.97 51.31,76.08
  Bottom 0.406: v46.51,85.04 44.87,85.04 U301.4 | v45.09,49.35 51.05,49.35 | 51.05,49.35 v51.77,50.07 | v51.31,84.94 51.31,77.68 | 51.31,77.68 51.31,76.08 v58.04,76.08 | v51.87,56.42 52.22,56.77 v56.01,56.77 | v55.37,33.12 54.59,33.12 54.59,30.23 | v41.15,51.39 41.15,56.85 40.77,57.23 40.77,58.7 40.08,59.39 v40.08,60.73 | v39.73,36.07 40.01,36.35 40.01,40.21 42.16,42.37 42.16,49.28 v41.4,50.04 | 54.59,30.23 61.21,30.23 61.21,33.53 61.98,34.29 61.98,36.81 63.75,38.59 72.21,38.59 74.65,41.02 74.65,45.19 74.8,45.34 | v39.73,33.3 39.73,30.23 54.59,30.23 | F-VDD_3V3.P$1 51.89,49.35 51.05,49.35 | v40.56,68.84 40.56,68.91 40.39,69.09 35.05,69.09 34.19,69.95 v33.81,69.95 | v41.17,70.26 41.17,71.38 43.2,73.41 46.38,73.41 48.41,75.44 50.85,75.44 51.31,75.9 51.31,75.97 | v31.01,62.23 v27.94,62.23 | 51.31,77.68 49.71,77.68 v49.2,78.18 | v72.9,45.34 74.8,45.34 | 74.8,45.34 v75.46,45.34
FMU-VDD_5V5
  Top 0.406: L603.P$2 57.65,80.57 C601.P$1 | U603.3 57.85,82.54 C601.P$1 | C615.P$1 59.19,80.77 C601.P$1
FMU_AUX_ADC1  (via drill 0.3 pad 0.55)
  Top 0.254: U101.18 71.72,66.51 v71.65,66.45 | v71.55,60.84 62.92,60.84 v62.74,60.66
  Top 0.406: v60.55,51.92 59.11,51.92 57.91,50.73 R408.1
  Bottom 0.254: 71.55,66.35 v71.65,66.45 71.4,66.19 71.4,60.99 v71.55,60.84
  Bottom 0.305: v62.74,60.66 62.74,54.1 v60.55,51.92
FMU_AUX_ADC2  (via drill 0.3 pad 0.55)
  Top 0.254: U101.33 69.05,69.94 67.31,68.2 63.17,68.2 v60.73,65.76
  Top 0.406: R407.1 55.37,50.62 56.67,51.92 v57.53,51.92
  Bottom 0.305: v57.53,51.92 59.13,51.92 60.73,53.52 v60.73,65.76
FMU_AUX_ADC2_PROT  (via drill 0.3 pad 0.55)
  Top 0.305: R407.2 55.35,47.9 55.35,46.56 49.96,41.18 49.96,15.62 v49.84,15.5
  Top 0.406: v43.43,12.19 43.43,8.61 42.7,7.88 J404.2
  Bottom 0.305: v43.43,12.19 50.52,12.19 51.28,12.96 51.28,15.37 51.16,15.5 v49.84,15.5
FRAM_MISO
  Top 0.254: U101.53 52.45,69.01 U102.2
FRAM_MOSI  (via drill 0.3 pad 0.55)
  Top 0.254: U101.54 54.56,68.51 v54.38,68.33
  Top 0.406: U102.5 46.97,71.5 v45.92,72.54
  Bottom 0.254: v45.92,72.54 45.11,72.54 44.2,71.63 42.49,71.63 41.91,71.05 41.91,69.34 42.93,68.33 v54.38,68.33
FRAM_SCK  (via drill 0.3 pad 0.55)
  Top 0.254: U102.6 46.1,70.23 45.21,71.12 v45.21,71.66 | U101.52 55.44,69.51 v55.22,69.73
  Bottom 0.254: v45.21,71.66 44.68,71.12 42.77,71.12 42.42,70.77 42.42,69.7 43.03,69.09 54.59,69.09 v55.22,69.73
GND  (via drill 0.3, 0.3 pad 0.55, 0.5 pad 0.81, 1)  (1 unrouted)
  Top 0.254: U602.6 38.36,54.46 U602.P$3 | U602.2 38.86,54.76 U602.P$2 | U601.P$3 40.39,46.33 U601.6 40.39,44.54 39.06,44.54 39.04,44.53 39.04,43.19 R617.1 | U601.2 40.89,46.63 U601.P$2 | L404.P$4 L404.P$3 42.16,13.97 42.41,14.22 D403.A | 24.59,92.27 R213.1 | C608.P$2 72.64,54.1 72.05,54.7 U101.99 72.05,57.22 71.32,57.94 69.57,57.94 | B601.2 77.98,53.08 77.98,53.14 | 65.65,44.91 C402.P$2 | U701.47 23.15,82.08 | C704.P$2 35.7,88.8 | U101.27 72.05,73.07 72.44,73.46 75.18,73.46 75.17,73.47 C607.P$2 | L201.P$5 L201.P$4 | U101.20 70.94,67.51 69.67,66.25 68.28,66.25 v67.31,65.28 | 53.61,58.51 53.61,58.45 | U701.35 26.2,90.14 | R206.1 49.53,91.95 | 57.92,73.41 57.53,73.41 57.53,72.39 C606.P$2 | 34.33,86.58 U701.23 31.51,86.58 31.04,86.11 v30.23,86.11 | U701.8 29.2,78.78 30.23,77.75 30.23,77.73 | X101.2 78.91,62.51 U101.10 70.33,62.51 69.93,62.11 67.94,62.11 v67.31,62.74 | 60.01,58.51 U101.74 57.44,58.51 56.49,57.56 53.62,57.56 53.59,57.53 53.59,58.42 53.57,58.45 | 64.24,62.74 v64.26,62.74 | D401.A | L401.P$4 L401.P$5 L401.P$3 | U302.2 22.86,67.31 22.61,67.57 | 79.08,60.38 C102.P$2
  Top 0.305: U901.10 11.56,32.51 | U902.10 30.36,32.31 30.28,32.31 | U902.14 28.41,33.82 28.45,33.78 | U902.13 29.06,33.89 28.96,33.78 | C705.P$2 26.43,76.7 X701.2 | 42.16,12.19 L404.P$4 | L201.P$3 L201.P$5 | 63.25,14.99 L203.P$4 L203.P$5 L203.P$3 63.25,12.8 61.87,12.8 61.77,12.7 | L202.P$5 L202.P$3 59.94,12.96 59.8,12.81 D202.A | 17.68,94.43 S701.B3 | U506.3 U506.2 84.67,79.66 | R610.2 72.3,78.07 | C606.P$2 56.86,72.34 | 86.89,44.72 C302.P$2 | C612.P$2 C103.P$1 | 69.94,48.77 R611.1 | C613.P$2 53.61,58.88 | 65.38,39.09 74.32,39.09 | C611.P$2 57.92,73.41 | U303.2 87,43.46 | C302.P$2 86.88,43.58 86.89,43.56 | 88.8,69.9 88.82,69.9 | 86.88,45.43 C302.P$2 | 88.63,69.35 S601.B3 | 88.8,69.64 S601.B3 | S601.B3 88.86,71.29 88.32,71.83 | L904.P$4 L904.P$5 L904.P$3 | L401.P$4 49.84,12.98 50.01,12.8 50.01,12.21 D401.A | L201.P$4 53.85,12.96 54.1,12.7 54.1,12.2 D201.A
  Top 0.406: U901.14 9.62,33.77 9.65,33.73 | U901.13 10.27,33.74 10.26,33.73 | C913.P$2 11.45,34.31 11.43,34.29 | C914.P$2 30.29,34.1 29.97,33.78 | 80.25,64.6 X101.4 | 79.26,62.4 X101.2 | C915.P$2 3.56,33.02 | 2.1,33.02 C909*.P$2 2.15,26.93 R906*.1 | C916.P$2 22.35,33.28 | R908*.1 20.89,24.89 C910*.P$2 20.89,33.09 21.08,33.28 | R616.1 36.58,51.31 | U601.GND 42.67,46.48 43.69,47.5 C614.P$2 | U602.P$3 U602.GND U602.P$2 39.98,54.61 40.16,54.79 | 40.89,46.63 40.79,46.63 U601.GND | U601.GND U601.P$3 | 64.52,14.99 63.25,14.99 | C301.P$2 79.38,44.59 | C401.P$2 77.48,40.91 78.23,41.66 79.35,41.66 U303.8 | 24.59,91.44 24.59,92.27 | 64.64,43.31 U401.8 64.64,39.83 65.38,39.09 71.6,39.09 | C610.P$2 53.61,58.45 | C912.P$2 32.51,32.01 31.5,33.02 | 29.72,33.02 31.5,33.02 | 71.6,39.09 72.26,39.75 U401.2 | 71.6,39.09 74.39,39.09 74.87,39.58 79.69,39.58 79.7,39.58 86.46,39.58 87,40.11 U303.2 | 13.51,90.93 14.28,91.7 15.72,91.7 15.72,94.56 S701.B3 | R615.1 37.44,47.49 37.44,48.41 | 12.7,33.02 10.92,33.02 | C911.P$2 13.72,32.01 12.7,33.02 | R915.1 v33.03,26.81 v33.02,26.8 | R914.1 v14.22,26.81 v14.22,26.8 | USB1.GND 4.32,65.79 4.22,65.69 USB1.GND3 1.97,66.08 USB1.GND4 | R910.1 13.6,33.02 12.7,33.02 | R911.1 32.4,33.02 31.5,33.02
  Top 0.61: 3.56,33.02 6.35,33.02 | 25.15,32.01 25.15,33.28 22.35,33.28 21.08,33.28 | v28.7,14.48 v28.7,16 v28.7,18.29 v28.7,19.81
  Top 0.813: v1.02,13.97 2.6,13.97 C901.2 2.6,15.5 v1.02,15.5 | v1.02,18.04 2.6,18.04 C902.2 | v1.02,19.56 2.54,19.56 2.54,18.8
  Top 1.016: v28.7,19.81 27.11,19.81 C906.2 26.92,19.12 | v28.7,18.29 26.92,18.29 26.92,19.31 | v28.7,16 27.11,16 C905.2 27.11,14.48 v28.7,14.48
  Bottom 0.203: U503.20 73.82,85.69 73.81,85.7 | U503.18 72.24,84.57 72.24,85.7
  Bottom 0.254: 6.3,74.68 R212.1 | 69.1,92.46 69.12,92.44 U504.18 73.28,92.43 73.43,92.28 75.95,92.28 76.1,92.44 U504.1 | 73.81,85.7 72.24,85.7 | 5.59,84.03 C202.P$2 | 56.57,91.24 56.57,90.66 | 56.57,90.66 56.57,89.92 55.64,89.92 C509.P$2 55.63,89.92 | U504.1 77.17,92.44 | 66.32,58.57 65.81,59.08 65.81,62.72 | 56.57,90.66 57.9,90.66 57.91,90.68 | 57.28,88.66 57.9,88.66 57.91,88.65 | 57.91,89.16 56.9,89.16 56.9,89.66 57.91,89.66 | 57.91,90.17 56.9,90.17 | U504.1 | 89.5,48.24 89.5,92.93 87.44,94.99 | 55.89,94.99 53.95,93.04 53.72,93.04 | 53.72,93.04 42.18,93.04 40.58,94.64 35.66,94.64 32.23,91.21 26.98,91.21 | 53.72,93.04 54.43,92.33 59.31,92.33 59.44,92.2 U502.15
  Bottom 0.305: L404.P$5 42.16,12.19 | C515.P$2 69.1,92.46 C514.P$2 C513.P$2 | C203.P$2 v5.08,83.06 5.59,83.06 5.59,84.03 | C506.P$2 79.74,84.84 | 42.77,93.96 45.21,93.96 | 55.61,89.92 C509.P$2
  Bottom 0.406: U601.P$2 U601.P$3 34.8,46.48 v35.05,46.74 | U602.P$3 U602.P$2 | R916.2 13.98,53.34 v14.73,53.34 | v33.02,26.8 v33.02,33.02
  Bottom 0.61: v28.7,14.48 v28.7,16 v28.7,18.29 v28.7,19.81
  Bottom 0.813: v1.02,15.5 2.6,15.5 C901.2 | v1.02,15.5 2.03,15.5 | 2.54,14.73 2.54,13.97 v1.02,13.97 v1.02,15.5 | v1.02,18.04 2.6,18.04 C902.2 2.6,19.56 v1.02,19.56 | v1.02,19.56 v1.02,15.5 | v1.02,15.5 1.02,14.73 | v1.02,19.56 v1.02,21.85 v1.02,23.37 v1.02,24.89 v1.02,26.42 v1.02,27.94 v1.02,29.47 v1.02,31.24 v1.02,32.77 v1.02,34.04 v1.02,35.56 v1.02,37.09
  Bottom 1.016: v28.7,19.81 27.11,19.81 C906.2 27.11,18.8 | v28.7,18.29 27.11,18.29 27.11,18.8 | C905.2 27.11,14.48 v28.7,14.48 | v28.7,16 26.92,16 26.92,15.24 | R916.2 13.98,49.53 | 32.77,50.04 R917.2 | 26.92,18.61 27.11,18.8